# EAGLE design vent bjt2 (EAGLE 9.3.2)
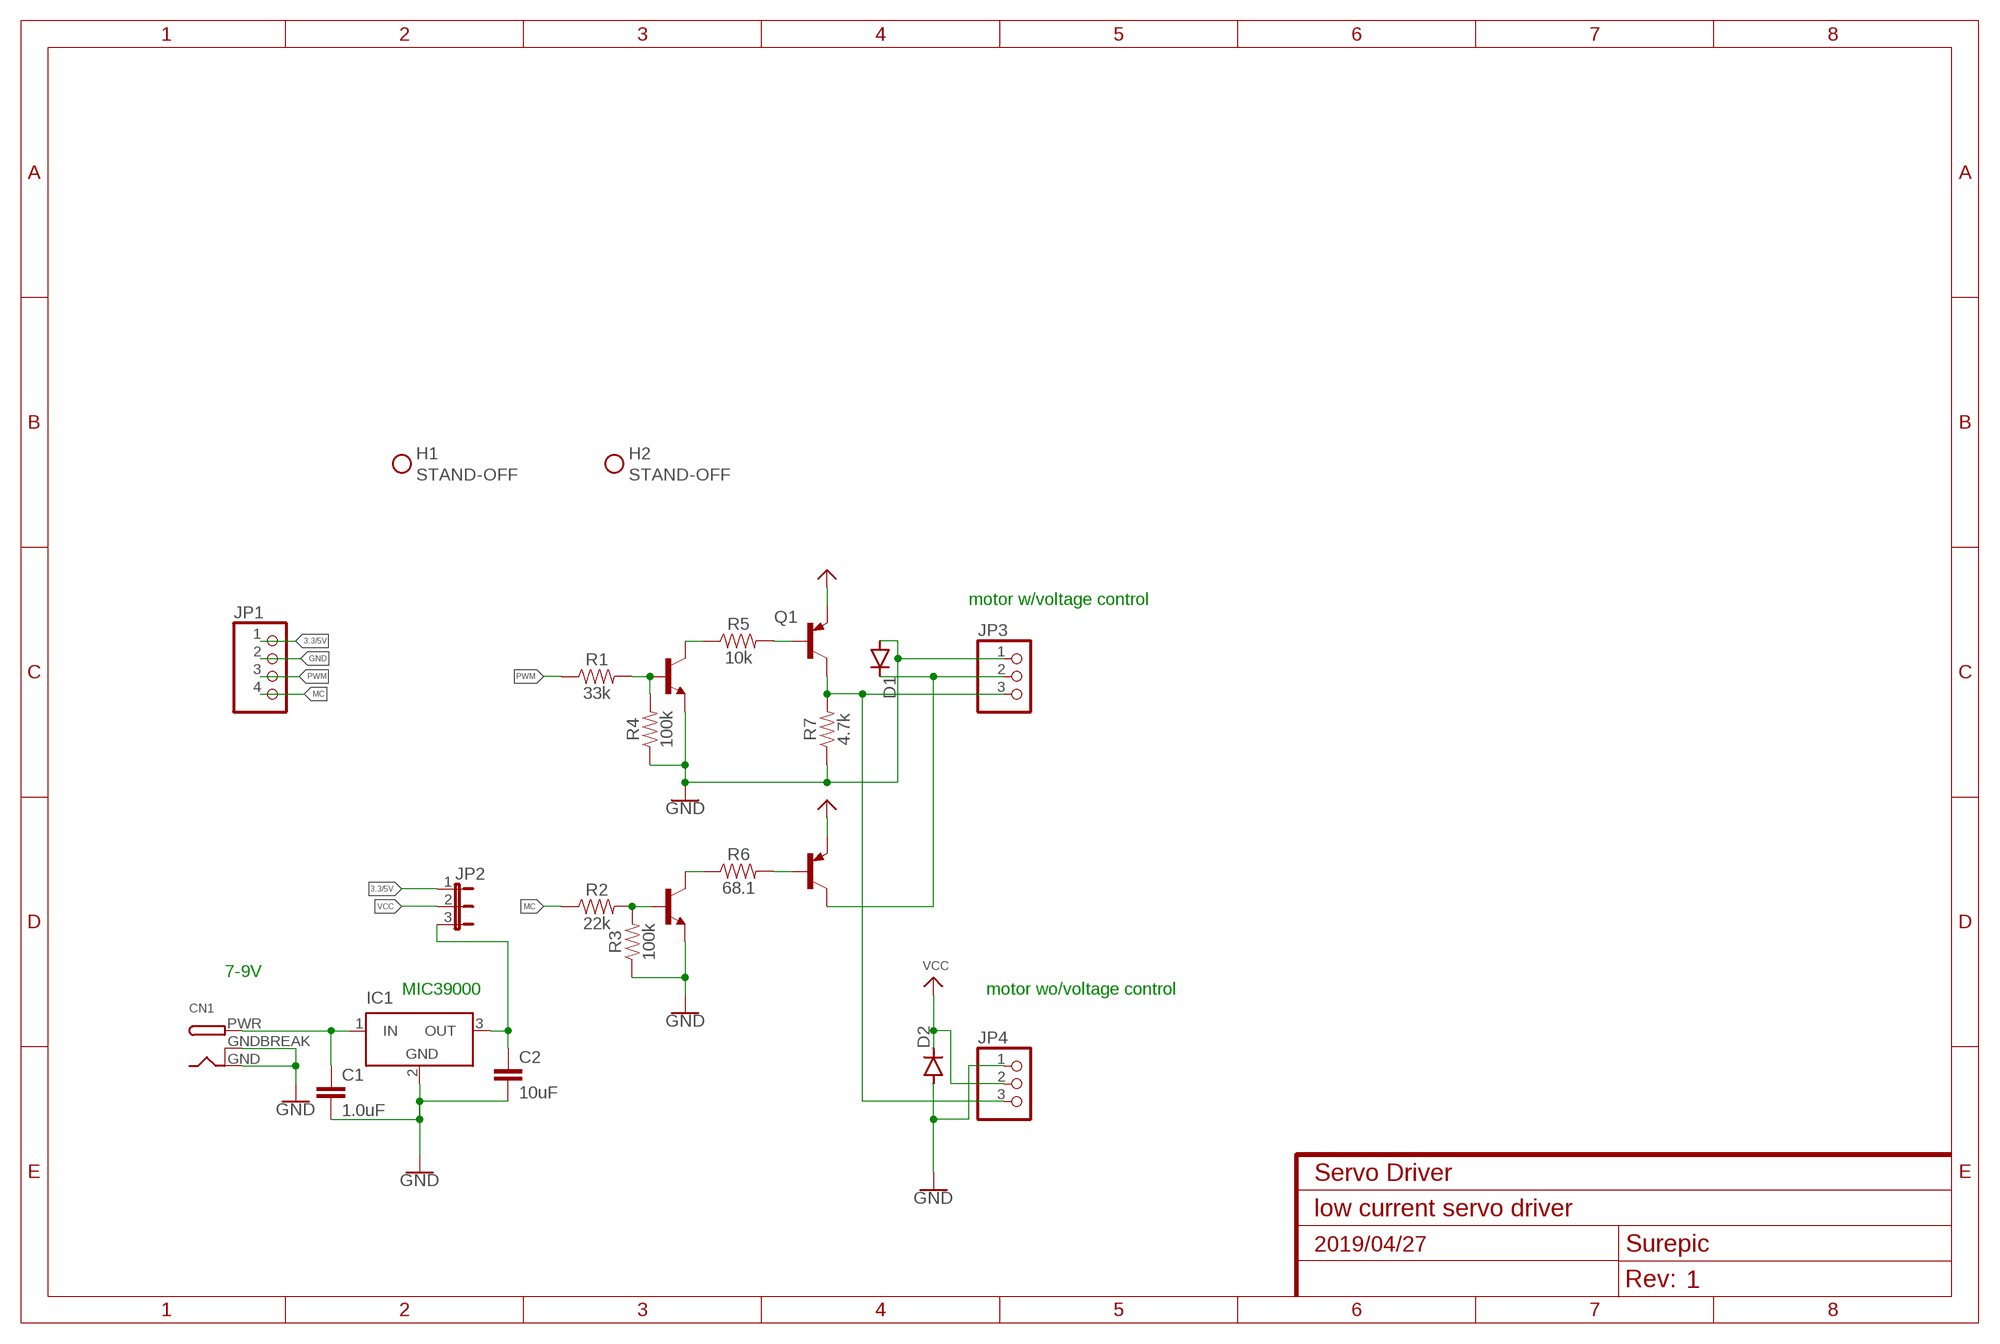
[diagram p0: schematic, sheet 1]

## Parts
C1  1.0uF  1.0UF-0603-16V-10%  [0603]
C2  10uF  10UF-0603-6.3V-20%  [0603]
C945  C945  2SC1815  [TO92-ECB]
CN1  DCBARRELPTH  [DCJACK_2MM_PTH]
D1  1N4148DO35-7  [DO35-7]
D2  1N4148DO35-7  [DO35-7]
H1  STAND-OFF  [STAND-OFF]
H2  STAND-OFF  [STAND-OFF]
IC1  LT1129CST5  [SOT223]
JP1  PINHD-1X4  [1X04]
JP2  JP2E  [JP2]
JP3  PINHD-1X3  [1X03]
JP4  PINHD-1X3  [1X03]
Q1  2N2907  [TO92-EBC-OVAL]
R1  33k  33KOHM-0603-1/10W-1%  [0603]
R2  22k  22KOHM-0603-1/10W-1%  [0603]
R3  100k  100KOHM-0603-1/10W-1%  [0603]
R4  100k  100KOHM-0603-1/10W-1%  [0603]
R5  10k  10KOHM-0603-1/10W-1%  [0603]
R6  68.1  68.1KOHM-0603-1/10W-1%  [0603]
R7  4.7k  4.7KOHM-0603-1/10W-1%  [0603]
S8550  S8550  2N2907  [TO92-EBC-OVAL]
T1  S9018  2N2222  [TO92-EBC-OVAL]

## Nets
3.3/5V [power]: JP1.1 JP2.1
GND [power]: C1.2 C2.2 C945.E CN1.GND CN1.GNDBREAK D1.A D2.A IC1.2(GND) JP1.2 JP3.1 JP4.1 R3.1 R4.1 R7.1 T1.E
MC: JP1.4 R2.1
N$1: R1.2 R4.2 T1.B
N$2 [power]: D1.C JP3.2 S8550.C
N$3: R5.1 T1.C
N$4: Q1.B R5.2
N$5: JP3.3 JP4.3 Q1.C R7.2
N$7: C945.B R2.2 R3.2
N$8 [power]: C1.1 CN1.PWR IC1.1(IN)
N$9: C945.C R6.1
N$10: R6.2 S8550.B
N$15 [power]: C2.1 IC1.3(OUT) JP2.3
PWM: JP1.3 R1.1
VCC [power]: D2.C JP2.2 JP4.2 Q1.E S8550.E

## Notes on the sheet
- motor w/voltage control
- 7-9V
- MIC39000 | motor wo/voltage control

## Power pins joined to a net without a drawn wire
GND: IC1.4(GND)

## Library data of the parts
C1 = SparkFun-Capacitors:1.0UF: 1µF ceramic capacitors A capacitor is a passive two-terminal electrical component used to store electrical energy temporarily in an electric field.; PROD_ID: CAP-00868
C2 = SparkFun-Capacitors:10UF: 10.0µF ceramic capacitors A capacitor is a passive two-terminal electrical component used to store electrical energy temporarily in an electric field.; PROD_ID: CAP-11015
C945 = transistor:2SC1815: NPN EPITAXIAL TRANSISTOR Source: TOSHIBA .. 2SC1815 1.pdf
CN1 = adafruit:DCBARREL: 2.0mm DC Barrel Jack DCJACK_2MM_PTH - Through Hole Jack (4UConnector: 05537)
D1 D2 = diode:1N4148: DIODE high speed (Philips)
H1 H2 = SparkFun-Hardware:STAND-OFF: Stand Off Drill holes for mechanically mounting via screws, standoffs, etc. Note: Use the keepout ring to avoid running the screw head into surrounding components. Variant Overviews STAND-OFF - Mechanical footprint for a #4 phillips button head screw. STAND-OFF-TIGHT - Mechanical footprint for a #4 phillips button head screw, Example SparkFun Products Screw - Phillips Head (1/4", 4-40, 10 pack) <https://www.sparkfun.com/products/10453> (PRT-10453) Screw - Phillips Head (1/2", 4-40, 10 pack) <https://www.sparkfun.com/products/10452> (PRT-10452) Screw - Phillips Head (3/4", 4-40, 10 pack) <https://www.sparkfun.com/products/10451> (PRT-10451) Screw - Phillips Head (1", 4-40, 10 pack) <https://www.sparkfun.com/products/10450> (PRT-10450)
IC1 = linear-technology:LT1129CST5: VOLTAGE REGULATOR with shutdown; MPN: LT1129CST-5#PBF; OC_FARNELL: 1663375; OC_NEWARK: 57M2069
JP1 = pinhead:PINHD-1X4: PIN HEADER
JP2 = jumper:JP2E: JUMPER
JP3 JP4 = adafruit:PINHD-1X3: PIN HEADER
Q1 S8550 = adafruit:2N2907*: PNP Transistor Big Oval pads
R1 = SparkFun-Resistors:33KOHM: 33kΩ resistor A resistor is a passive two-terminal electrical component that implements electrical resistance as a circuit element. Resistors act to reduce current flow, and, at the same time, act to lower voltage levels within circuits. - Wikipedia; PROD_ID: RES-08416
R2 = SparkFun-Resistors:22KOHM: 22kΩ resistor A resistor is a passive two-terminal electrical component that implements electrical resistance as a circuit element. Resistors act to reduce current flow, and, at the same time, act to lower voltage levels within circuits. - Wikipedia; PROD_ID: RES-07853
R3 R4 = SparkFun-Resistors:100KOHM: 100kΩ resistor A resistor is a passive two-terminal electrical component that implements electrical resistance as a circuit element. Resistors act to reduce current flow, and, at the same time, act to lower voltage levels within circuits. - Wikipedia; PROD_ID: RES-07828
R5 = SparkFun-Resistors:10KOHM: 10kΩ resistor A resistor is a passive two-terminal electrical component that implements electrical resistance as a circuit element. Resistors act to reduce current flow, and, at the same time, act to lower voltage levels within circuits. - Wikipedia; PROD_ID: RES-00824
R6 = SparkFun-Resistors:68.1KOHM: 68.1kΩ resistor A resistor is a passive two-terminal electrical component that implements electrical resistance as a circuit element. Resistors act to reduce current flow, and, at the same time, act to lower voltage levels within circuits. - Wikipedia; PROD_ID: RES-09380; VALUE: 68.1k
R7 = SparkFun-Resistors:4.7KOHM: 4.7kΩ resistor A resistor is a passive two-terminal electrical component that implements electrical resistance as a circuit element. Resistors act to reduce current flow, and, at the same time, act to lower voltage levels within circuits. - Wikipedia; PROD_ID: RES-07857
T1 = adafruit:2N2222: NPN TRANSISTOR Big oval pads

## Net classes
1 power: width 0.508 mm, drill 0.152 mm, clearance 0.152 mm

## Board
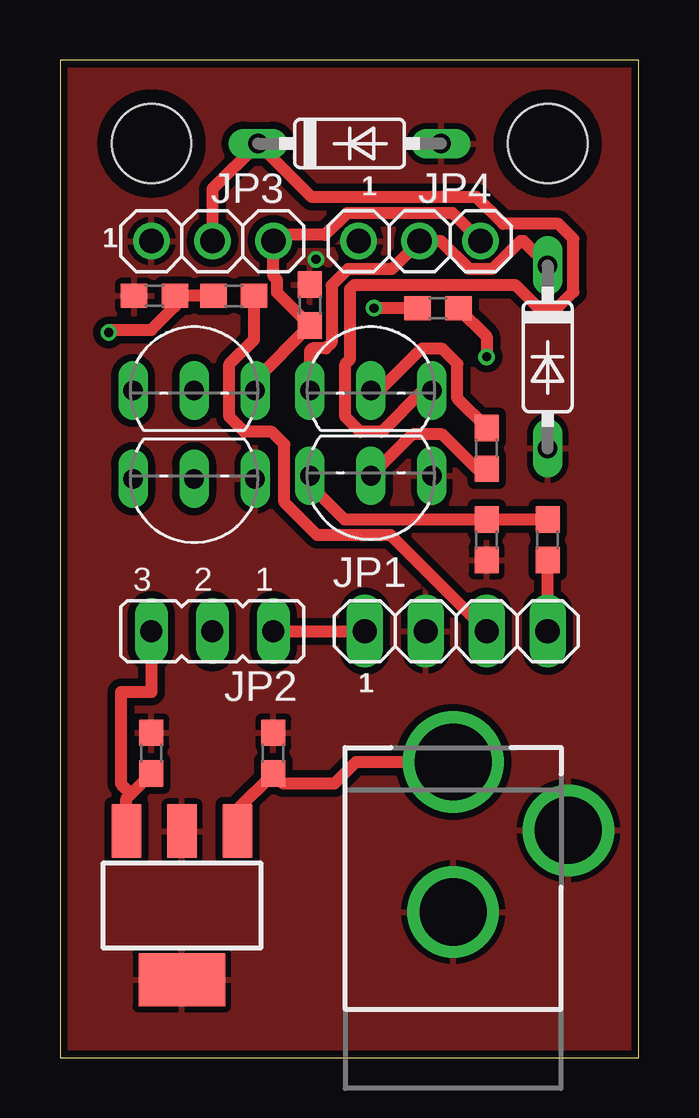
[diagram p1: board, top side]
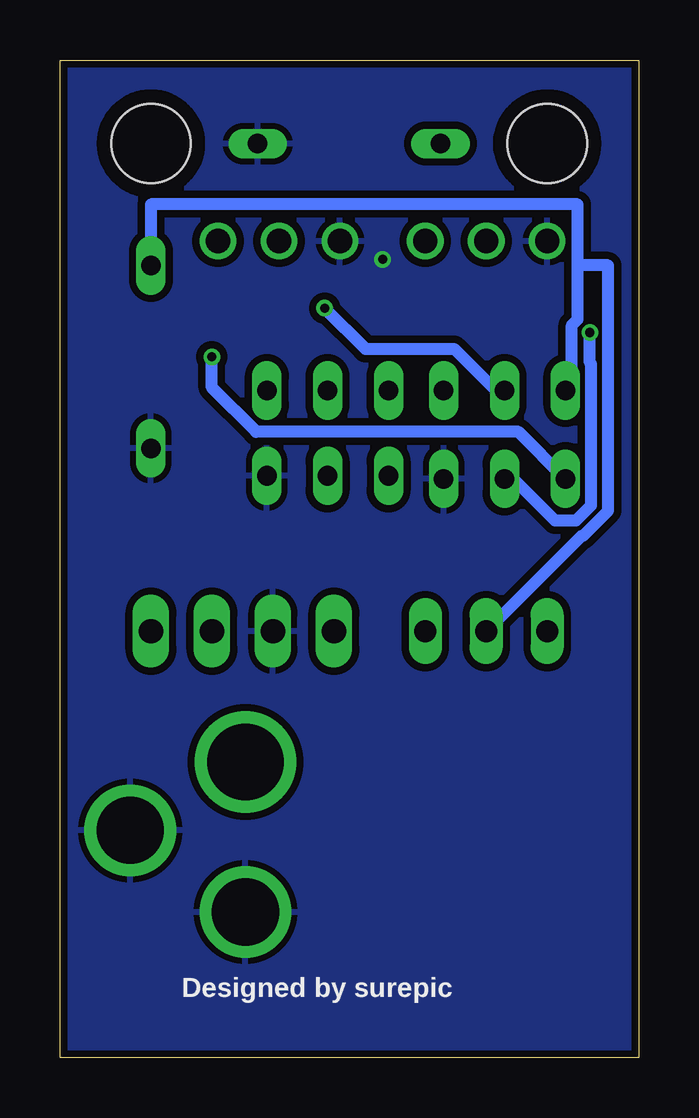
[diagram p2: board, bottom side, seen from below]

Size 24.11 x 41.58 mm. Coordinates in mm from the lower left corner, seen from the top.
Outline: 0,0 24.11,0 24.11,41.58 0,41.58 0,0
Copper layers (1*16): Top 0.035mm / dielectric 1.5mm / Bottom 0.035mm
Design rules "SparkFun-2-layer-PCBWay-LIMIT": minimum track width 6mil, minimum drill 0.3mm, track to track 6mil, track to pad 6mil, pad to pad 6mil, via to via 6mil, smd to smd 6mil, copper to edge 6mil, drill to drill 6mil, minimum pad ring 6mil, minimum via ring 6mil, stop-mask expansion 4mil, vias tented up to drill 25mil, thermal gap 10mil

### Footprints (pad centres in the part's own frame; a part is rotated, then mirrored left to right if it is on the bottom)
0603 = smd 1.1 x 1: 1 -0.85,0; 2 0.85,0
TO92-ECB = drill 0.813 long: B 2.54,0; C 0,0; E -2.54,0
DCJACK_2MM_PTH = drill 2.8: GND 0,7.35; GNDBREAK 4.8,10.75 | drill 3.2: PWR 0,13.6
DO35-7 = drill 0.813 long: A 3.81,0; C -3.81,0
STAND-OFF = hole 3.302: 0,0
SOT223 = smd 1.219 x 2.235: 1 -2.311,-3.099; 2 0,-3.099; 3 2.311,-3.099 | smd 3.6 x 2.2: 4 0,3.099
1X04 = drill 1.016 long: 1 -3.81,0; 2 -1.27,0; 3 1.27,0; 4 3.81,0
JP2 = drill 0.914 long: 1 -2.54,0; 2 0,0; 3 2.54,0
1X03 = drill 1.016: 1 -2.54,0; 2 0,0; 3 2.54,0
TO92-EBC-OVAL = drill 0.813 long: B 0,-1.27; C 2.54,-1.27; E -2.54,-1.27

### Placement (x,y rotation side)
C1  8.89,12.7 90 top
C2  3.81,12.7 90 top
C945  12.95,24.26 180 top
CN1  16.38,-1.27 0 top
D1  12.06,38.1 0 top
D2  20.32,29.21 270 top
H1  20.32,38.1 0 top
H2  3.81,38.1 0 top
IC1  5.08,6.35 180 top
JP1  16.51,17.78 0 top
JP2  6.35,17.78 180 top
JP3  6.35,34.04 0 top
JP4  14.99,34.04 0 top
Q1  5.59,29.08 0 top
R1  7.24,31.75 180 top
R2  20.32,21.59 90 top
R3  17.78,21.59 90 top
R4  3.94,31.75 0 top
R5  15.75,31.24 180 top
R6  17.78,25.4 90 top
R7  10.41,31.37 270 top
S8550  12.95,29.08 0 top
T1  5.59,22.86 180 top

### Tracks (layer width: path | path; a pad name or v marks a point on that pad's centre or on a via)
3.3/5V
  Top 0.508: JP2.1 JP1.1
GND  (via drill 0.38)
  other vias: 10.67,33.27
  pour Top (isolate 0.305): 0,0 0,41.91 24.13,41.91 24.13,0
  pour Bottom (isolate 0.305): 0,0 0,41.91 24.13,41.91 24.13,0
MC
  Top 0.508: JP1.4 R2.1
N$1  (via drill 0.38)
  Top 0.508: R1.2 R4.2 4.79,31.32 3.81,30.34 2.14,30.34 v2.03,30.23
  Bottom 0.508: v2.03,30.23 2.03,28.97 1.98,28.91 1.98,23.03 2.61,22.4 3.49,22.4 5.22,24.13 T1.B
N$2
  Top 0.508: JP3.2 6.35,36.2 D1.C 10.49,35.87 17.35,35.87 18.47,34.75 20.76,34.75 21.39,34.12 21.39,31.92 20.76,31.29 19.88,31.29 18.96,32.21 12.27,32.21 12.09,32.03 12.09,29.12 11.89,28.91 11.89,26.71 12.51,26.09 13.4,26.09 15.12,27.81 S8550.C
N$3  (via drill 0.38)
  Top 0.508: R5.1 17.78,30.06 v17.78,29.21
  Bottom 0.508: T1.C 5,26.09 15.94,26.09 17.78,27.93 v17.78,29.21
N$4  (via drill 0.38)
  Top 0.508: R5.2 v13.08,31.24
  Bottom 0.508: v13.08,31.24 11.38,29.54 7.69,29.54 5.96,27.81 Q1.B
N$5
  Top 0.152: JP3.3 8.91,34.06 8.91,34.29
  Top 0.508: Q1.C 8.13,28.23 R7.2 9.04,31.89 9.04,32.42 8.89,32.57 JP3.3 | 8.91,34.29 11.05,34.29 11.96,35.2 16.36,35.2 JP4.3
N$7
  Top 0.508: R2.2 R3.2 11.85,22.44 10.41,23.88 C945.B
N$8
  Top 0.508: IC1.1 7.39,10.35 C1.1 9.31,11.43 11.43,11.43 12.33,12.33 CN1.PWR
N$9
  Top 0.508: R6.1 17.37,24.55 15.94,25.98 14.68,25.98 C945.C
N$10
  Top 0.508: R6.2 16.56,27.47 16.56,28.91 15.94,29.54 15.05,29.54 13.32,27.81 S8550.B
N$15
  Top 0.508: IC1.3 2.77,10.81 2.96,11.01 | 2.96,11.01 C2.1 | JP2.3 3.81,15.24 2.54,15.24 2.54,11.43 2.96,11.01
PWM
  Top 0.508: JP1.3 13.78,21.78 10.72,21.78 9.35,23.16 9.35,25.56 8.82,26.09 7.69,26.09 7.06,26.71 7.06,28.91 8.09,29.94 R1.1
VCC
  Top 0.508: D2.C 19.3,34.04 19.18,34.04 18.01,32.87 17.04,32.87 15.87,34.04 JP4.2 13.82,32.87 12,32.87 11.32,32.19 11.32,29.8 11.08,29.56 10.51,29.56 10.41,29.46 S8550.E
  Bottom 0.508: 2.54,33.02 2.54,30.78 2.78,30.54 2.78,28.08 Q1.E | 2.54,33.02 2.54,35.56 20.32,35.56 D2.C | JP2.2 2.39,21.74 2.33,21.74 1.27,22.8 1.27,33.02 2.54,33.02

### Text on the board
bPlace: Designed by surepic
tNames: 1 | 1 | 1